# EAGLE schematic main board roller (EAGLE 9.5.1)
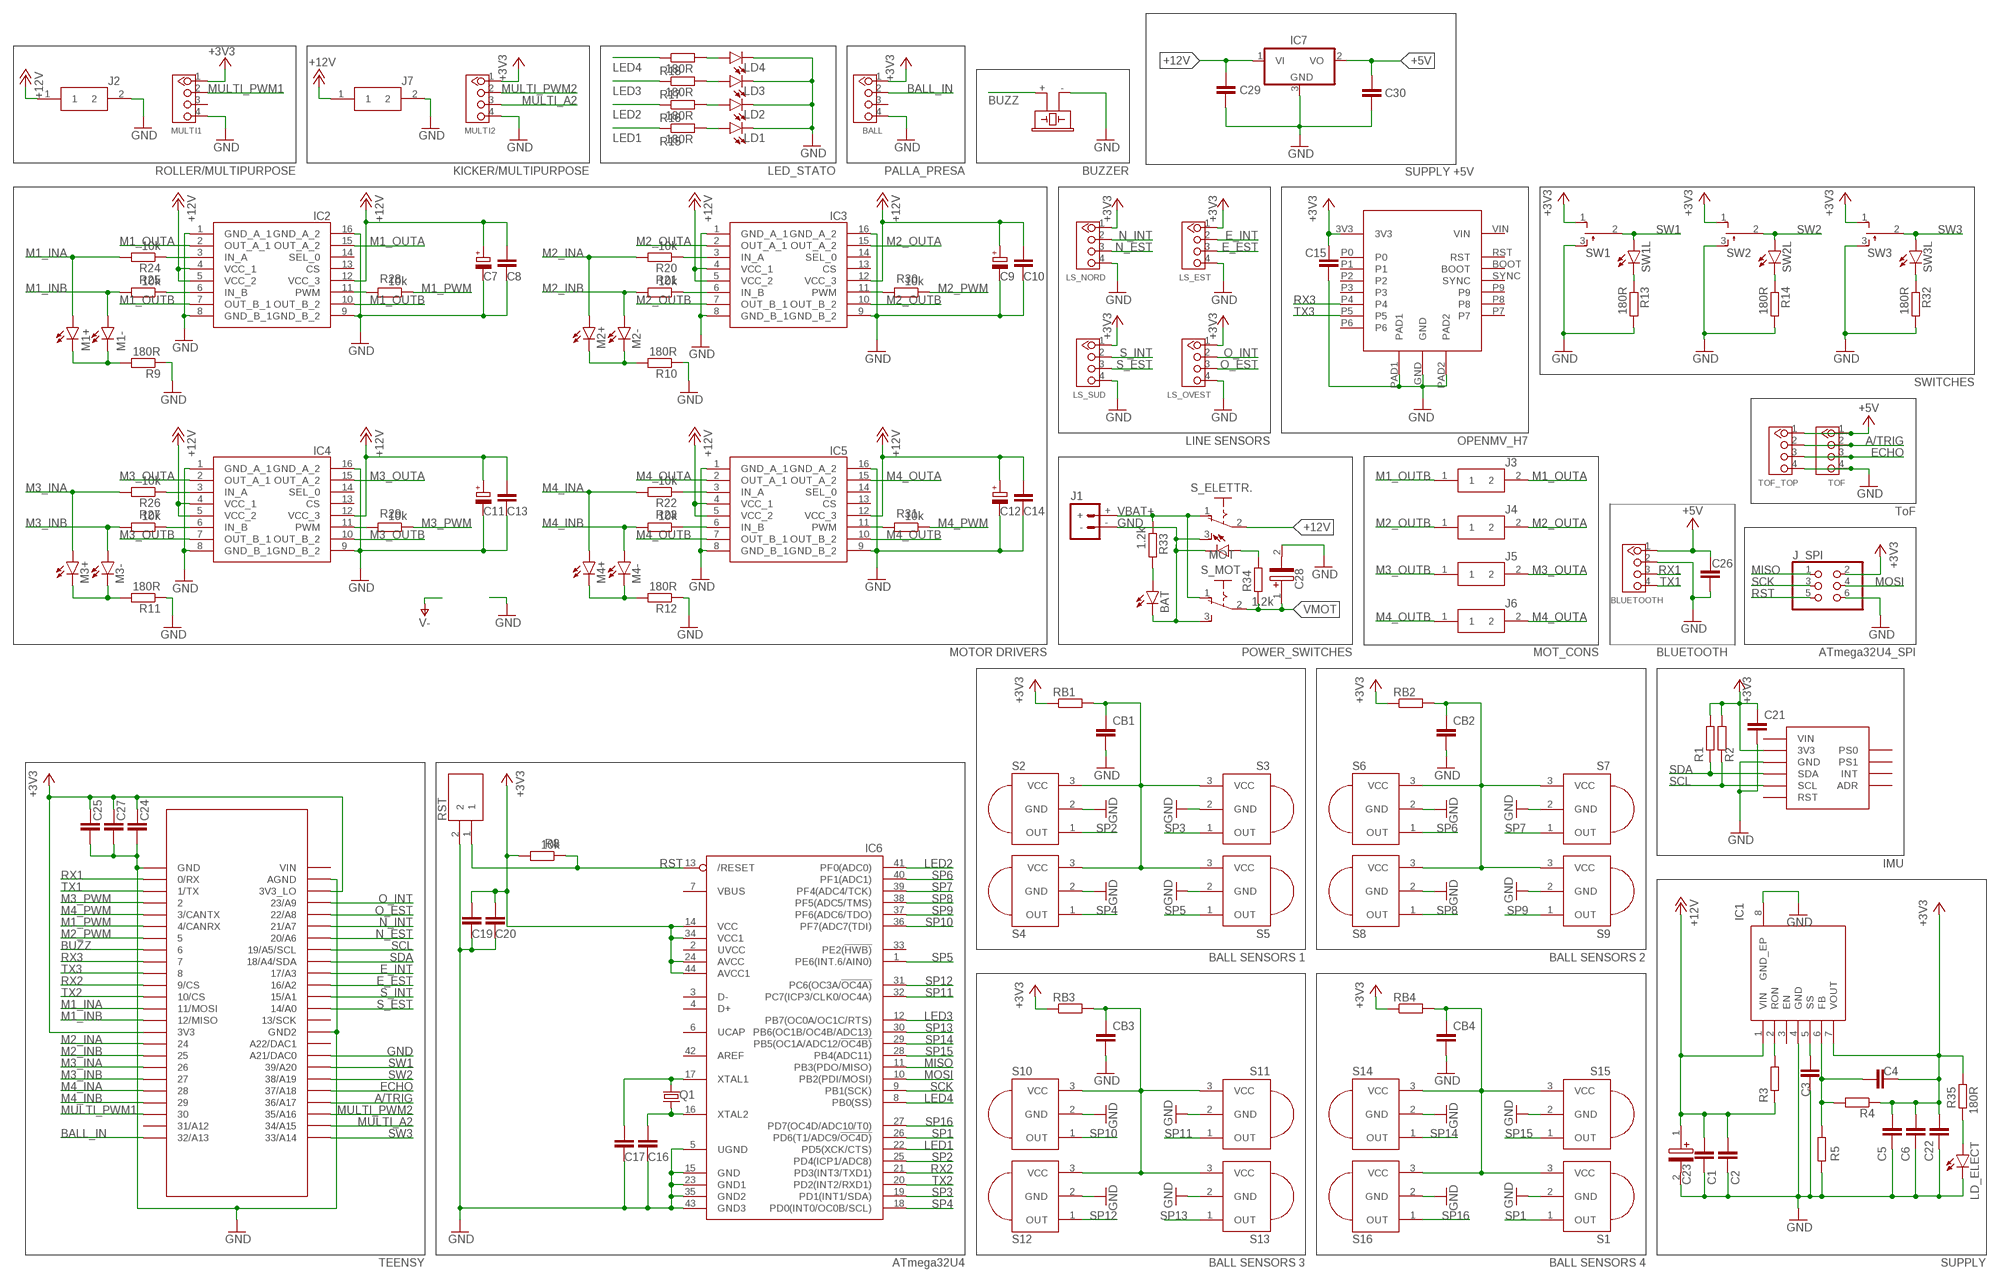
[diagram p0: schematic, sheet 1]

## Parts
BALL  TWIG_2.0  [2.0_1X4]
BAT  LEDCHIPLED_1206  [CHIPLED_1206]
BLUETOOTH  TWIG_2.0  [2.0_1X4]
BUZZER  F/CM12P  [F/CM12P]
C1  100n  C-EUC0805  [C0805]
C2  100n  C-EUC0805  [C0805]
C3  22n  C-EUC0805  [C0805]
C4  22n  C-EUC0805  [C0805]
C5  100u  C-EUC1206  [C1206]
C6  100u  C-EUC1206  [C1206]
C7  1OOu  CPOL-EUE  [PANASONIC_E]
C8  1u  C-EUC0805  [C0805]
C9  100u  CPOL-EUE  [PANASONIC_E]
C10  1u  C-EUC0805  [C0805]
C11  100u  CPOL-EUE  [PANASONIC_E]
C12  100u  CPOL-EUE  [PANASONIC_E]
C13  1u  C-EUC0805  [C0805]
C14  1u  C-EUC0805  [C0805]
C15  1u  C-EUC0805  [C0805]
C16  22pF  C-EUC0805  [C0805]
C17  22pF  C-EUC0805  [C0805]
C19  1u  C-EUC1206  [C1206]
C20  1u  C-EUC0805  [C0805]
C21  1u  C-EUC0805  [C0805]
C22  100n  C-EUC0805  [C0805]
C23  EEV-FK1C152Q  [FKV(H13)]
C24  100n  C-EUC0805  [C0805]
C25  100n  C-EUC1206  [C1206]
C26  1u  C-EUC0805  [C0805]
C27  100n  C-EUC0805  [C0805]
C28  EEV-FK1C152Q  [FKV(H13)]
C29  1uF  C-EUC0805  [C0805]
C30  1uF  C-EUC0805  [C0805]
CB1  0.1uF  C-EUC0805  [C0805]
CB2  0.1uF  C-EUC0805  [C0805]
CB3  0.1uF  C-EUC0805  [C0805]
CB4  0.1uF  C-EUC0805  [C0805]
IC1  LMZ14202TZE-ADJ_NOPB  [NDW0007A]
IC2  VNH7070ASTR  [SOIC127P600X175-16N]
IC3  VNH7070ASTR  [SOIC127P600X175-16N]
IC4  VNH7070ASTR  [SOIC127P600X175-16N]
IC5  VNH7070ASTR  [SOIC127P600X175-16N]
IC6  ATMEGA32U4-AU  [TQFP44]
IC7  7805DT  [TO252]
J1  BATTERY_CONN_DEANS  [DEANS]
J2  43650-0201  [43650-0200]
J3  43650-0201  [43650-0200]
J4  43650-0201  [43650-0200]
J5  43650-0201  [43650-0200]
J6  43650-0201  [43650-0200]
J7  43650-0201  [43650-0200]
J_SPI  PINHD-2X3  [2X03]
LD1  LEDCHIPLED_1206  [CHIPLED_1206]
LD2  LEDCHIPLED_1206  [CHIPLED_1206]
LD3  LEDCHIPLED_1206  [CHIPLED_1206]
LD4  LEDCHIPLED_1206  [CHIPLED_1206]
LD_ELECT  LEDCHIPLED_1206  [CHIPLED_1206]
LS_EST  TWIG_2.0  [2.0_1X4]
LS_NORD  TWIG_2.0  [2.0_1X4]
LS_OVEST  TWIG_2.0  [2.0_1X4]
LS_SUD  TWIG_2.0  [2.0_1X4]
M1+  LEDCHIPLED_1206  [CHIPLED_1206]
M1-  LEDCHIPLED_1206  [CHIPLED_1206]
M2+  LEDCHIPLED_1206  [CHIPLED_1206]
M2-  LEDCHIPLED_1206  [CHIPLED_1206]
M3+  LEDCHIPLED_1206  [CHIPLED_1206]
M3-  LEDCHIPLED_1206  [CHIPLED_1206]
M4+  LEDCHIPLED_1206  [CHIPLED_1206]
M4-  LEDCHIPLED_1206  [CHIPLED_1206]
MOT  LEDCHIPLED_1206  [CHIPLED_1206]
MULTI1  TWIG_2.0  [2.0_1X4]
MULTI2  TWIG_2.0  [2.0_1X4]
Q1  CRYSTALHC49UP  [HC49UP]
R1  10k  R-EU_R0805  [R0805]
R2  10k  R-EU_R0805  [R0805]
R3  61,9k  R-EU_R0805  [R0805]
R4  3,32k  R-EU_R0805  [R0805]
R5  1,07k  R-EU_R0805  [R0805]
R8  10k  R-EU_R0805  [R0805]
R9  180R  R-EU_R0805  [R0805]
R10  180R  R-EU_R0805  [R0805]
R11  180R  R-EU_R0805  [R0805]
R12  180R  R-EU_R0805  [R0805]
R13  180R  R-EU_R0805  [R0805]
R14  180R  R-EU_R0805  [R0805]
R15  180R  R-EU_R0805  [R0805]
R16  180R  R-EU_R0805  [R0805]
R17  180R  R-EU_R0805  [R0805]
R18  180R  R-EU_R0805  [R0805]
R20  10k  R-EU_R0805  [R0805]
R21  10k  R-EU_R0805  [R0805]
R22  10k  R-EU_R0805  [R0805]
R23  10k  R-EU_R0805  [R0805]
R24  10k  R-EU_R0805  [R0805]
R25  10k  R-EU_R0805  [R0805]
R26  10k  R-EU_R0805  [R0805]
R27  10k  R-EU_R0805  [R0805]
R28  10k  R-EU_R0805  [R0805]
R29  10k  R-EU_R0805  [R0805]
R30  10k  R-EU_R0805  [R0805]
R31  10k  R-EU_R0805  [R0805]
R32  180R  R-EU_R0805  [R0805]
R33  1.2k  R-EU_R0805  [R0805]
R34  1.2k  R-EU_R0805  [R0805]
R35  180R  R-EU_R0805  [R0805]
RB1  22  R-EU_R0805  [R0805]
RB2  22  R-EU_R0805  [R0805]
RB3  22  R-EU_R0805  [R0805]
RB4  22  R-EU_R0805  [R0805]
RST  KSR231GLFS  [KSR]
S1  PNA460XM  [PNA460XM]
S2  PNA460XM  [PNA460XM]
S3  PNA460XM  [PNA460XM]
S4  PNA460XM  [PNA460XM]
S5  PNA460XM  [PNA460XM]
S6  PNA460XM  [PNA460XM]
S7  PNA460XM  [PNA460XM]
S8  PNA460XM  [PNA460XM]
S9  PNA460XM  [PNA460XM]
S10  PNA460XM  [PNA460XM]
S11  PNA460XM  [PNA460XM]
S12  PNA460XM  [PNA460XM]
S13  PNA460XM  [PNA460XM]
S14  PNA460XM  [PNA460XM]
S15  PNA460XM  [PNA460XM]
S16  PNA460XM  [PNA460XM]
S_ELETTR.  255SB  [255SB]
S_MOT  255SB  [255SB]
SW1  TL38PO  [TL3XPO]
SW1L  LEDCHIPLED_1206  [CHIPLED_1206]
SW2  TL38PO  [TL3XPO]
SW2L  LEDCHIPLED_1206  [CHIPLED_1206]
SW3  TL38PO  [TL3XPO]
SW3L  LEDCHIPLED_1206  [CHIPLED_1206]
TOF  TWIG_2.0  [2.0_1X4]
TOF_TOP  TWIG_2.0  [2.0_1X4]
U$1  TEENSY_3.5/3.6  [TEENSY_3.5/3.6]
U$2  OPENMV_H7  [OPENMV_H7]
U$4  BNO055  [BNO055]

## Nets
+3V3: BALL.1 C4.2 C5.1 C6.1 C15.1 C19.1 C20.1 C21.1 C22.1 C24.1 C25.1 C27.1 IC1.7(VOUT) IC6.14(VCC) IC6.24(AVCC) IC6.34(VCC1) IC6.44(AVCC1) J_SPI.2 LS_EST.1 LS_NORD.1 LS_OVEST.1 LS_SUD.1 MULTI1.1 MULTI2.1 R1.2 R2.2 R4.1 R8.2 R35.2 RB1.1 RB2.1 RB3.1 RB4.1 SW1.1(O) SW2.1(O) SW3.1(O) U$1.3V3 U$1.3V3_LO U$2.3V3 U$4.3V3
+5V: BLUETOOTH.1 C26.1 C30.1 IC7.2(VO) TOF.1 TOF_TOP.1 ; supply symbol labelled +3V3
+12V: C1.1 C2.1 C23.1(+) C29.1 IC1.1(VIN) IC7.1(VI) J2.1 J7.1 R3.1 S_ELETTR..2(P)
A/TRIG: TOF.2 TOF_TOP.2 U$1.36/A17
BALL_IN: BALL.2 U$1.32/A13
BUZZ: BUZZER.+ U$1.6
E_EST: LS_EST.3 U$1.16/A2
E_INT: LS_EST.2 U$1.17/A3
ECHO: TOF.3 TOF_TOP.3 U$1.37/A18
GND [Power]: BALL.4 BAT.C BLUETOOTH.2 BUZZER.- C1.2 C2.2 C3.2 C5.2 C6.2 C7.- C8.2 C9.- C10.2 C11.- C12.- C13.2 C14.2 C15.2 C16.2 C17.2 C19.2 C20.2 C21.2 C22.2 C23.2(-) C24.2 C25.2 C26.2 C27.2 C28.2(-) C29.2 C30.2 CB1.2 CB2.2 CB3.2 CB4.2 IC1.4(GND) IC1.8(GND_EP) IC2.1(GND_A_1) IC2.8(GND_B_1) IC2.9(GND_B_2) IC2.16(GND_A_2) IC3.1(GND_A_1) IC3.8(GND_B_1) IC3.9(GND_B_2) IC3.16(GND_A_2) IC4.1(GND_A_1) IC4.8(GND_B_1) IC4.9(GND_B_2) IC4.16(GND_A_2) IC5.1(GND_A_1) IC5.8(GND_B_1) IC5.9(GND_B_2) IC5.16(GND_A_2) IC6.5(UGND) IC6.15(GND) IC6.23(GND1) IC6.35(GND2) IC6.43(GND3) IC7.3(GND) J1.- J2.2 J7.2 J_SPI.6 LD1.C LD2.C LD3.C LD4.C LD_ELECT.C LS_EST.4 LS_NORD.4 LS_OVEST.4 LS_SUD.4 MOT.C MULTI1.4 MULTI2.4 R5.1 R9.1 R10.1 R11.1 R12.1 R13.2 R14.2 R32.2 RST.2 S1.2(GND) S2.2(GND) S3.2(GND) S4.2(GND) S5.2(GND) S6.2(GND) S7.2(GND) S8.2(GND) S9.2(GND) S10.2(GND) S11.2(GND) S12.2(GND) S13.2(GND) S14.2(GND) S15.2(GND) S16.2(GND) S_ELETTR..3(S) S_MOT.3(S) SW1.3(S) SW2.3(S) SW3.3(S) TOF.4 TOF_TOP.4 U$1.21/DAC0(A21/DAC0) U$1.AGND U$1.GND U$1.GND2 U$2.GND U$2.PAD1 U$2.PAD2 U$4.GND
INA_1: IC2.3(IN_A) R24.1
INA_2: IC3.3(IN_A) R20.1
INA_3: IC4.3(IN_A) R26.1
INA_4: IC5.3(IN_A) R22.1
INB_1: IC2.6(IN_B) R25.1
INB_2: IC3.6(IN_B) R21.1
INB_3: IC4.6(IN_B) R27.1
INB_4: IC5.6(IN_B) R23.1
LED1: IC6.22(PD5(XCK/CTS)) R15.1
LED2: IC6.41(PF0(ADC0)) R16.1
LED3: IC6.12(PB7(OC0A/OC1C/RTS)) R17.1
LED4: IC6.8(PB0(SS)) R18.1
M1_INA: M1+.A R24.2 U$1.11/MOSI
M1_INB: M1-.A R25.2 U$1.12/MISO
M1_OUTA: IC2.2(OUT_A_1) IC2.15(OUT_A_2) J3.2
M1_OUTB: IC2.7(OUT_B_1) IC2.10(OUT_B_2) J3.1
M1_PWM: R28.1 U$1.4/CANRX
M2_INA: M2+.A R20.2 U$1.24
M2_INB: M2-.A R21.2 U$1.25
M2_OUTA: IC3.2(OUT_A_1) IC3.15(OUT_A_2) J4.2
M2_OUTB: IC3.7(OUT_B_1) IC3.10(OUT_B_2) J4.1
M2_PWM: R30.1 U$1.5
M3_INA: M3+.A R26.2 U$1.26
M3_INB: M3-.A R27.2 U$1.27
M3_OUTA: IC4.2(OUT_A_1) IC4.15(OUT_A_2) J5.2
M3_OUTB: IC4.7(OUT_B_1) IC4.10(OUT_B_2) J5.1
M3_PWM: R29.1 U$1.2
M4_INA: M4+.A R22.2 U$1.28
M4_INB: M4-.A R23.2 U$1.29
M4_OUTA: IC5.2(OUT_A_1) IC5.15(OUT_A_2) J6.2
M4_OUTB: IC5.7(OUT_B_1) IC5.10(OUT_B_2) J6.1
M4_PWM: R31.1 U$1.3/CANTX
MISO: IC6.11(PB3(PDO/MISO)) J_SPI.1
MOSI: IC6.10(PB2(PDI/MOSI)) J_SPI.4
MULTI_A2: MULTI2.3 U$1.34/A15
MULTI_PWM1: MULTI1.2 U$1.30
MULTI_PWM2: MULTI2.2 U$1.35/A16
N$1: IC1.2(RON) R3.2
N$2: C4.1 IC1.6(FB) R4.2 R5.2
N$3: C3.1 IC1.5(SS)
N$4: LD4.A R18.2
N$5: C17.1 IC6.17(XTAL1) Q1.2
N$6: C16.1 IC6.16(XTAL2) Q1.1
N$13: M2+.C M2-.C R10.2
N$14: M1+.C M1-.C R9.2
N$15: M3+.C M3-.C R11.2
N$16: M4+.C M4-.C R12.2
N$17: R13.1 SW1L.C
N$18: R14.1 SW2L.C
N$19: R32.1 SW3L.C
N$20: LD1.A R15.2
N$21: LD2.A R16.2
N$22: LD3.A R17.2
N$24: BAT.A R33.2
N$25: MOT.A R34.2
N$26: LD_ELECT.A R35.1
N_EST: LS_NORD.3 U$1.20/A6
N_INT: LS_NORD.2 U$1.21/A7
O_EST: LS_OVEST.3 U$1.22/A8
O_INT: LS_OVEST.2 U$1.23/A9
POWER_BLOCK_1: CB1.1 RB1.2 S2.3(VCC) S3.3(VCC) S4.3(VCC) S5.3(VCC)
POWER_BLOCK_2: CB2.1 RB2.2 S6.3(VCC) S7.3(VCC) S8.3(VCC) S9.3(VCC)
POWER_BLOCK_3: CB3.1 RB3.2 S10.3(VCC) S11.3(VCC) S12.3(VCC) S13.3(VCC)
POWER_BLOCK_4: CB4.1 RB4.2 S1.3(VCC) S14.3(VCC) S15.3(VCC) S16.3(VCC)
PWM3: IC4.11(PWM) R29.2
PWM_1: IC2.11(PWM) R28.2
PWM_2: IC3.11(PWM) R30.2
PWM_4: IC5.11(PWM) R31.2
RST: IC6.13(/RESET) J_SPI.5 R8.1 RST.1
RX1: BLUETOOTH.3 U$1.0/RX
RX2: IC6.21(PD3(INT3/TXD1)) U$1.9/CS
RX3: U$1.7 U$2.P4
S_EST: LS_SUD.3 U$1.14/A0
S_INT: LS_SUD.2 U$1.15/A1
SCK: IC6.9(PB1(SCK)) J_SPI.3
SCL: R2.1 U$1.19/A5/SCL U$4.SCL
SDA: R1.1 U$1.18/A4/SDA U$4.SDA
SP1: IC6.26(PD6(T1/ADC9/!OC4D)) S1.1(OUT)
SP2: IC6.25(PD4(ICP1/ADC8)) S2.1(OUT)
SP3: IC6.19(PD1(INT1/SDA)) S3.1(OUT)
SP4: IC6.18(PD0(INT0/OC0B/SCL)) S4.1(OUT)
SP5: IC6.1(PE6(INT.6/AIN0)) S5.1(OUT)
SP6: IC6.40(PF1(ADC1)) S6.1(OUT)
SP7: IC6.39(PF4(ADC4/TCK)) S7.1(OUT)
SP8: IC6.38(PF5(ADC5/TMS)) S8.1(OUT)
SP9: IC6.37(PF6(ADC6/TDO)) S9.1(OUT)
SP10: IC6.36(PF7(ADC7(TDI)) S10.1(OUT)
SP11: IC6.32(PC7(ICP3/CLK0/OC4A)) S11.1(OUT)
SP12: IC6.31(PC6(OC3A/!OC4A)) S12.1(OUT)
SP13: IC6.30(PB6(OC1B/OC4B/ADC13)) S13.1(OUT)
SP14: IC6.29(PB5(OC1A/ADC12/!OC4B)) S14.1(OUT)
SP15: IC6.28(PB4(ADC11)) S15.1(OUT)
SP16: IC6.27(PD7(OC4D/ADC10/T0)) S16.1(OUT)
SW1: SW1.2(P) SW1L.A U$1.39/A20
SW2: SW2.2(P) SW2L.A U$1.38/A19
SW3: SW3.2(P) SW3L.A U$1.33/A14
TX1: BLUETOOTH.4 U$1.1/TX
TX2: IC6.20(PD2(INT2/RXD1)) U$1.10/CS
TX3: U$1.8 U$2.P5
VBAT+: J1.+ R33.1 S_ELETTR..1(O) S_MOT.1(O)
VMOT [Power]: C7.+ C8.1 C9.+ C10.1 C11.+ C12.+ C13.1 C14.1 C28.1(+) IC2.4(VCC_1) IC2.5(VCC_2) IC2.12(VCC_3) IC3.4(VCC_1) IC3.5(VCC_2) IC3.12(VCC_3) IC4.4(VCC_1) IC4.5(VCC_2) IC4.12(VCC_3) IC5.4(VCC_1) IC5.5(VCC_2) IC5.12(VCC_3) R34.1 S_MOT.2(P) ; supply symbol labelled +12V
Unconnected: BALL.3 IC1.3(EN) IC2.13(CS) IC2.14(SEL_0) IC3.13(CS) IC3.14(SEL_0) IC4.13(CS) IC4.14(SEL_0) IC5.13(CS) IC5.14(SEL_0) IC6.2(UVCC) IC6.3(D-) IC6.4(D+) IC6.6(UCAP) IC6.7(VBUS) IC6.33(PE2(!HWB)) IC6.42(AREF) MULTI1.3 U$1.13/SCK U$1.31/A12 U$1.A22/DAC1 U$1.VIN U$2.BOOT U$2.P0 U$2.P1 U$2.P2 U$2.P3 U$2.P6 U$2.P7 U$2.P8 U$2.P9 U$2.RST U$2.SYNC U$2.VIN U$4.ADR U$4.INT U$4.PS0 U$4.PS1 U$4.RST U$4.VIN

## Notes on the sheet
- ROLLER/MULTIPURPOSE | KICKER/MULTIPURPOSE | LED_STATO | PALLA_PRESA | BUZZER | SUPPLY +5V
- SWITCHES
- LINE SENSORS | OPENMV_H7
- ToF
- MOTOR DRIVERS | POWER_SWITCHES | MOT_CONS | BLUETOOTH | ATmega32U4_SPI
- IMU
- BALL SENSORS 1 | BALL SENSORS 2
- TEENSY | ATmega32U4 | BALL SENSORS 3 | BALL SENSORS 4 | SUPPLY

## Library data of the parts
BALL BLUETOOTH LS_EST LS_NORD LS_OVEST LS_SUD MULTI1 MULTI2 TOF TOF_TOP = CONNECTER:TWIG_2.0
BAT LD1-LD4 LD_ELECT M1+ M1- M2+ M2- M3+ M3- M4+ M4- MOT SW1L SW2L SW3L = led:LED: LED OSRAM: - CHIPLED LG R971, LG N971, LY N971, LG Q971, LY Q971, LO R971, LY R971 LH N974, LH R974 LS Q976, LO Q976, LY Q976 LO Q996 - Hyper CHIPLED LW Q18S LB Q993, LB Q99A, LB R99A - SideLED LS A670, LO A670, LY A670, LG A670, LP A670 LB A673, LV A673, LT A673, LW A673 LH A674 LY A675 LS A676, LA A676, LO A676, LY A676, LW A676 LS A679, LY A679, LG A679 - Hyper Micro SIDELED® LS Y876, LA Y876, LO Y876, LY Y876 LT Y87S - SmartLED LW L88C, LW L88S LB L89C, LB L89S, LG L890 LS L89K, LO L89K, LY L89K LS L896, LA L896, LO L896, LY L896 - TOPLED LS T670, LO T670, LY T670, LG T670, LP T670 LSG T670, LSP T670, LSY T670, LOP T670, LYG T670 LG T671, LOG T671, LSG T671 LB T673, LV T673, LT T673, LW T673 LH T674 LS T676, LA T676, LO T676, LY T676, LB T676, LH T676, LSB T676, LW T676 LB T67C, LV T67C, LT T67C, LS T67K, LO T67K, LY T67K, LW E67C LS E67B, LA E67B, LO E67B, LY E67B, LB E67C, LV E67C, LT E67C LW T67C LS T679, LY T679, LG T679 LS T770, LO T770, LY T770, LG T770, LP T770 LB T773, LV T773, LT T773, LW T773 LH T774 LS E675, LA E675, LY E675, LS T675 LS T776, LA T776, LO T776, LY T776, LB T776 LHGB T686 LT T68C, LB T68C - Hyper Mini TOPLED® LB M676 - Mini TOPLED Santana® LG M470 LS M47K, LO M47K, LY M47K Source: http://www.osram.convergy.de LUXEON: - LUMILED® LXK2-PW12-R00, LXK2-PW12-S00, LXK2-PW14-U00, LXK2-PW14-V00 LXK2-PM12-R00, LXK2-PM12-S00, LXK2-PM14-U00 LXK2-PE12-Q00, LXK2-PE12-R00, LXK2-PE12-S00, LXK2-PE14-T00, LXK2-PE14-U00 LXK2-PB12-K00, LXK2-PB12-L00, LXK2-PB12-M00, LXK2-PB14-N00, LXK2-PB14-P00, LXK2-PB14-Q00 LXK2-PR12-L00, LXK2-PR12-M00, LXK2-PR14-Q00, LXK2-PR14-R00 LXK2-PD12-Q00, LXK2-PD12-R00, LXK2-PD12-S00 LXK2-PH12-R00, LXK2-PH12-S00 LXK2-PL12-P00, LXK2-PL12-Q00, LXK2-PL12-R00 Source: www.luxeon.com KINGBRIGHT: KA-3528ASYC Source: www.kingbright.com
BUZZER = buzzer:F/CM12P: BUZZER Source: Buerklin; OC_FARNELL: unknown; OC_NEWARK: unknown
C1-C6 C8 C10 C13-C17 C19-C22 C24-C27 C29 C30 CB1-CB4 = rcl:C-EU: CAPACITOR, European symbol; SPICEPREFIX: C
C7 C9 C11 C12 = rcl:CPOL-EU: POLARIZED CAPACITOR, European symbol; SPICEPREFIX: C
C23 C28 = Panasonic 1500uF:EEV-FK1C152Q: PANASONIC ELECTRONIC COMPONENTS - EEV-FK1C152Q - ALUMINUM ELECTROLYTIC CAPACITOR, 1500UF, 16V, 20%, SMD, FULL REEL Source: Datasheet <https://industrial.panasonic.com/cdbs/www-data/pdf/RDE0000/ABA0000C1181.pdf>; ALLIED_NUMBER: 70258729; ALLIED_PRICE-STOCK: https://www.alliedelec.com/panasonic-eev-fk1c152q/70258729/; DESCRIPTION: PANASONIC ELECTRONIC COMPONENTS - EEV-FK1C152Q - ALUMINUM ELECTROLYTIC CAPACITOR, 1500UF, 16V, 20%, SMD, FULL REEL; HEIGHT: mm; MANUFACTURER_NAME: Panasonic; MANUFACTURER_PART_NUMBER: EEV-FK1C152Q; MOUSER_PART_NUMBER: 667-EEV-FK1C152Q; MOUSER_PRICE-STOCK: https://www.mouser.com/Search/Refine.aspx?Keyword=667-EEV-FK1C152Q
IC1 = LMZ14202TZE:LMZ14202TZE-ADJ_NOPB: Voltage Regulators - Switching Regulators 2A pwr Module w/ 42V Max Input Vtg Source: Datasheet <http://www.ti.com/lit/ds/symlink/lmz14202.pdf>; DESCRIPTION: Voltage Regulators - Switching Regulators 2A pwr Module w/ 42V Max Input Vtg; HEIGHT: mm; MANUFACTURER_NAME: Texas Instruments; MANUFACTURER_PART_NUMBER: LMZ14202TZE-ADJ/NOPB; MOUSER_PART_NUMBER: 926-LM14202TZEADJNPB; MOUSER_PRICE-STOCK: https://www.mouser.com/Search/Refine.aspx?Keyword=926-LM14202TZEADJNPB; RS_PART_NUMBER: 7981195P; RS_PRICE-STOCK: http://uk.rs-online.com/web/p/products/7981195P
IC2-IC5 = VNH7070AS:VNH7070ASTR: Motor / Motion / Ignition Controllers & Drivers Source: Datasheet <http://www.st.com/content/ccc/resource/technical/document/datasheet/08/97/0a/0c/cf/4b/41/40/DM00213876.pdf/files/DM00213876.pdf/jcr:content/translations/en.DM00213876.pdf>; DESCRIPTION: Motor / Motion / Ignition Controllers & Drivers; HEIGHT: 1.75mm; MANUFACTURER_NAME: STMicroelectronics; MANUFACTURER_PART_NUMBER: VNH7070ASTR; MOUSER_PART_NUMBER: 511-VNH7070ASTR; MOUSER_PRICE-STOCK: https://www.mouser.com/Search/Refine.aspx?Keyword=511-VNH7070ASTR; RS_PART_NUMBER: 1647017P; RS_PRICE-STOCK: http://uk.rs-online.com/web/p/products/1647017P
IC6 = Adafruit:ATMEGA32U4: http://www.ladyada.net/library/eagle
IC7 = linear:78*: Positive VOLTAGE REGULATOR Source: http://cache.national.com/ds/LM/LM78L05.pdf http://www.fairchildsemi.com/ds/LM/LM7805.pdf
J1 = SparkFun-Connectors:BATTERY_CONN: Battery Connectors Various footprints for battery connections SparkFun Products: Deans Connector -M/F Pair <https://www.sparkfun.com/products/11864>; SF_ID: PRT-11864
J2-J7 = Molex motori:43650-0201: MOLEX - 43650-0201 - PLUG & SOCKET CONNECTOR, HEADER 2POS 3MM Source: Datasheet <https://www.molex.com/pdm_docs/sd/436500201_sd.pdf>; ALLIED_NUMBER: 70090754; ALLIED_PRICE-STOCK: https://www.alliedelec.com/molex-incorporated-43650-0201/70090754/; DESCRIPTION: MOLEX - 43650-0201 - PLUG & SOCKET CONNECTOR, HEADER 2POS 3MM; HEIGHT: mm; MANUFACTURER_NAME: Molex; MANUFACTURER_PART_NUMBER: 43650-0201; MOUSER_PART_NUMBER: 538-43650-0201; MOUSER_PRICE-STOCK: https://www.mouser.com/Search/Refine.aspx?Keyword=538-43650-0201
J_SPI = pinhead:PINHD-2X3: PIN HEADER
Q1 = Adafruit:CRYSTAL: CRYSTAL; OC_FARNELL: unknown; OC_NEWARK: unknown
R1-R5 R8-R18 R20-R35 RB1-RB4 = rcl:R-EU_: RESISTOR, European symbol; SPICEPREFIX: R
RST = Switch:KSR231GLFS: Switch Tactile SMT gull wing 3.0N silver IP50 Tactile Switch, SPST-NO 50 mA dc 0.75mm Source: Datasheet <https://componentsearchengine.com/Datasheets/1/KSR231GLFS.pdf>; DESCRIPTION: Switch Tactile SMT gull wing 3.0N silver IP50 Tactile Switch, SPST-NO 50 mA dc 0.75mm; HEIGHT: mm; MANUFACTURER_NAME: C & K COMPONENTS; MANUFACTURER_PART_NUMBER: KSR231GLFS; MOUSER_PART_NUMBER: 611-KSR231GLFS; MOUSER_PRICE-STOCK: https://www.mouser.com/Search/Refine.aspx?Keyword=611-KSR231GLFS; RS_PART_NUMBER: 7931673P; RS_PRICE-STOCK: http://uk.rs-online.com/web/p/products/7931673P
S1-S16 = Adafruit:PNA460XM: IR 38KHz receiver PNA4602 and related receivers http://www.ladyada.net/library/pcb/eaglelibrary.html
S_ELETTR. S_MOT = Switch:255SB: SLIDING SWITCH Distributor Buerklin, 11G810
SW1-SW3 = switch:TL38PO: TINY SWITCH ON OFF MOM Source: http://www2.produktinfo.conrad.com/datenblaetter/700000-724999/705152-da-01-de-Subminiaturschalter_TL_36YO.pdf
U$1 = Teensy356:TEENSY_3.5/3.6
U$2 = OpenMV4:OPENMV_H7
U$4 = BNO055:BNO055

## Net classes
0 default: width 0.254 mm, drill 0.203 mm, clearance 0.203 mm
1 Power: width 0.305 mm, clearance 0.305 mm to class 0, clearance 0.305 mm
2 +5V/1: width 0.61 mm, drill 0.406 mm, clearance 0.254 mm to class 0, clearance 0.254 mm to class 1, clearance 0.254 mm